# EAGLE design DS2786 (EAGLE 7.3.0)
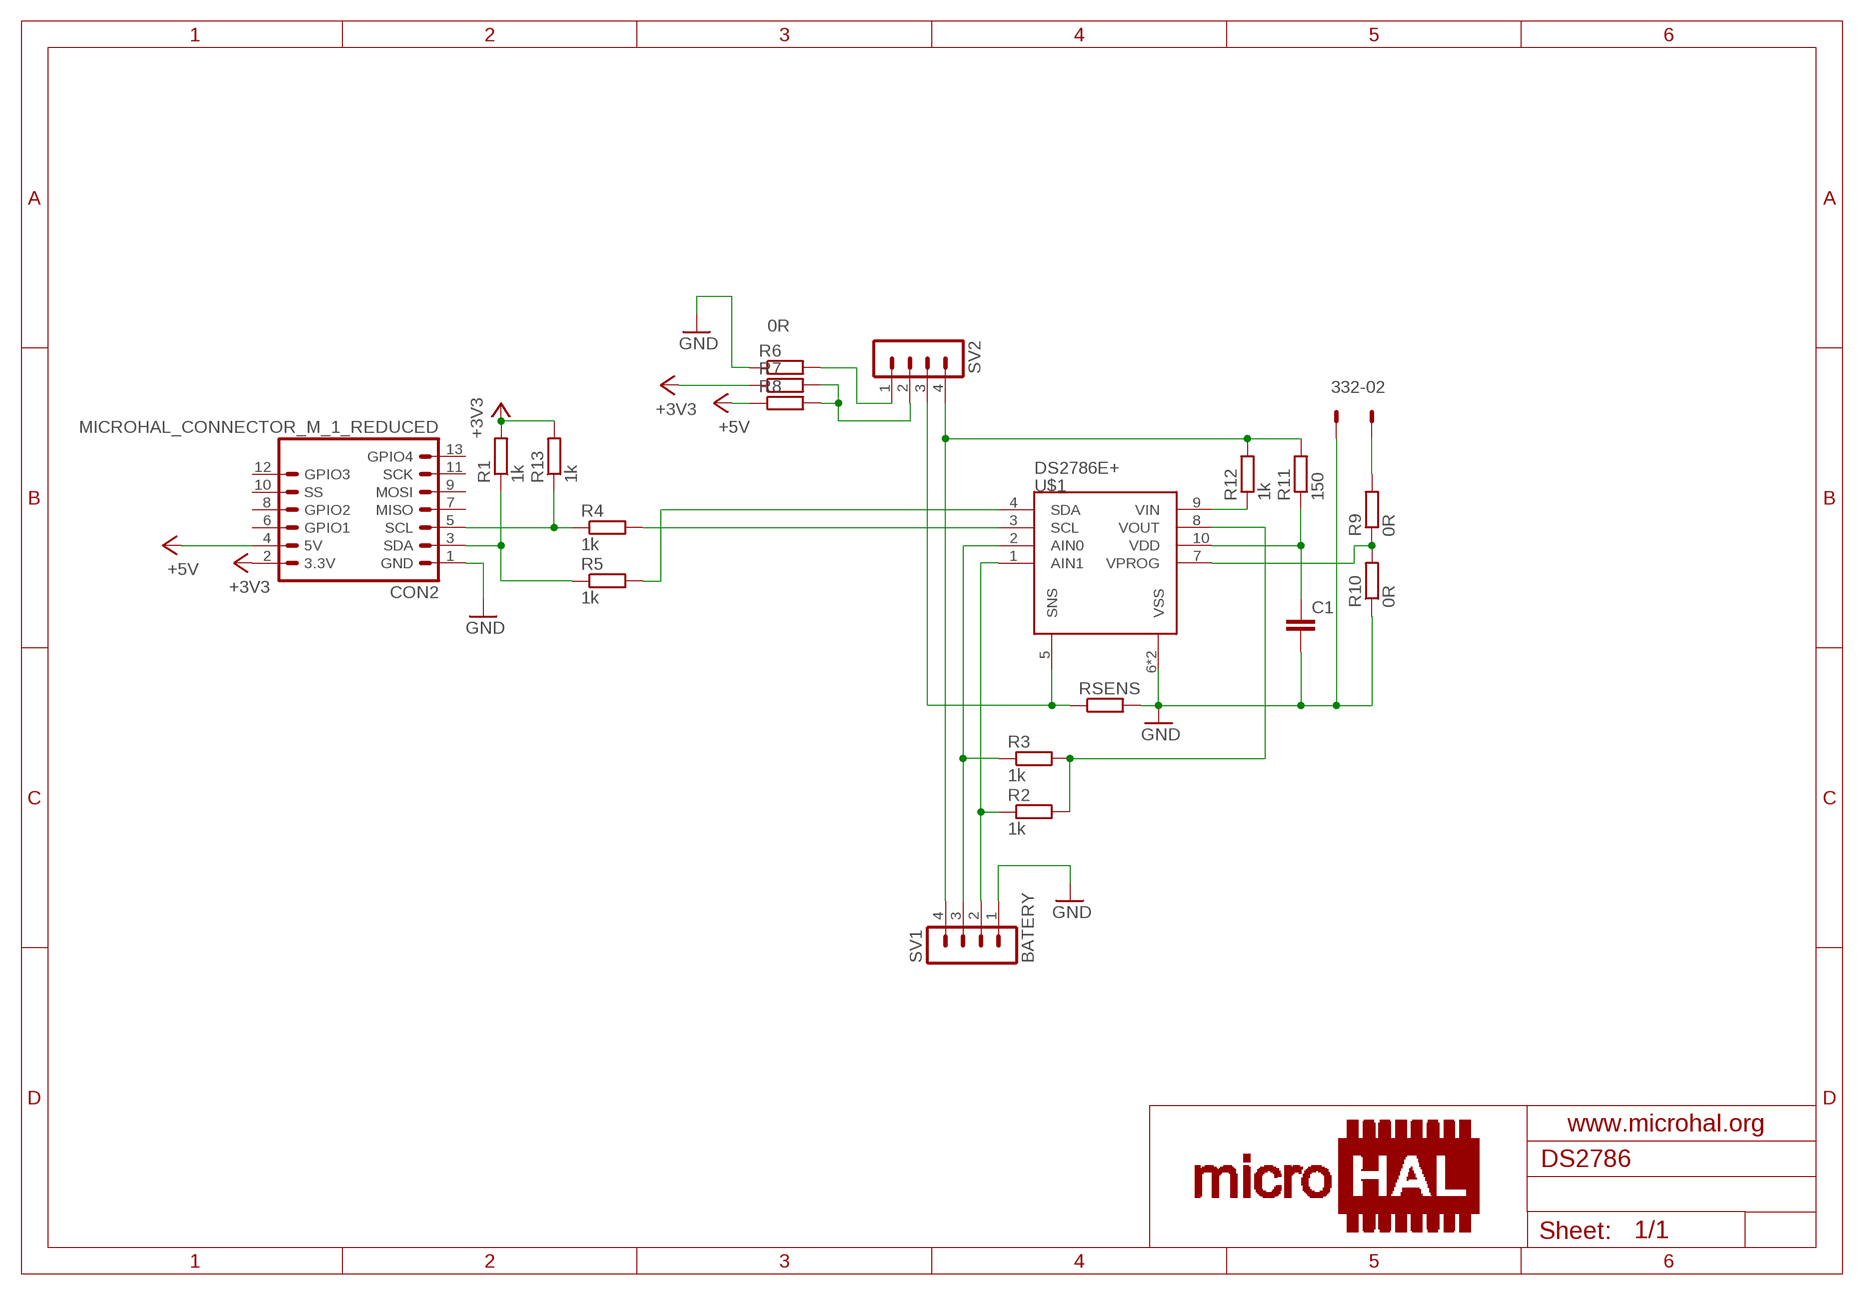
[diagram p0: schematic, sheet 1]

## Parts
C1  C-EUC0603  [C0603]
CON2  MICROHAL_CONNECTOR_M_1_REDUCED  [MICROHAL_CONNECTOR_M_1_REDUCED_EDGE]
R1  1k  R-EU_R0603  [R0603]
R2  1k  R-EU_R0603  [R0603]
R3  1k  R-EU_R0603  [R0603]
R4  1k  R-EU_R0603  [R0603]
R5  1k  R-EU_R0603  [R0603]
R6  R-EU_R0603  [R0603]
R7  R-EU_R0603  [R0603]
R8  R-EU_R0603  [R0603]
R9  0R  R-EU_R0603  [R0603]
R10  0R  R-EU_R0603  [R0603]
R11  150  R-EU_R0603  [R0603]
R12  1k  R-EU_R0603  [R0603]
R13  1k  R-EU_R0603  [R0603]
RSENS  R-EU_R1206  [R1206]
SV1  BATERY  MA04-1  [MA04-1]
SV2  MA04-1  [MA04-1]
U$1  DS2786E+  [TDFN-10]
X1  332-02  [332-02]

## Nets
+3V3: CON2.2(3.3V) R1.2 R7.1 R13.2
+5V: CON2.4(5V) R8.1
GND: C1.2 CON2.1(GND) R6.1 R10.1 RSENS.2 SV1.1 U$1.6(VSS) U$1.PAD1(VSS) X1.1
N$1: R9.2 X1.2
N$3: R2.2 R3.2 U$1.8(VOUT)
N$4: RSENS.1 SV2.3 U$1.5(SNS)
N$6: CON2.5(SCL) R4.1 R13.1
N$7: CON2.3(SDA) R1.1 R5.1
N$8: R4.2 U$1.3(SCL)
N$9: R5.2 U$1.4(SDA)
N$10: R11.2 R12.2 SV1.4 SV2.4
N$11: R6.2 SV2.1
N$12: R7.2 R8.2 SV2.2
N$15: C1.1 R11.1 U$1.10(VDD)
N$16: R9.1 R10.2 U$1.7(VPROG)
N$17: R12.1 U$1.9(VIN)
N$18: R2.1 SV1.2 U$1.1(AIN1)
N$20: R3.1 SV1.3 U$1.2(AIN0)
Unconnected: CON2.6(GPIO1) CON2.7(MISO) CON2.8(GPIO2) CON2.9(MOSI) CON2.10(SS) CON2.11(SCK) CON2.12(GPIO3) CON2.13(GPIO4)

## Notes on the sheet
- 0R

## Library data of the parts
C1 = rcl:C-EU: CAPACITOR, European symbol
CON2 = microhal-connector_v0.1:MICROHAL_CONNECTOR_M_1_REDUCED
R1-R13 RSENS = rcl:R-EU_: RESISTOR, European symbol
SV1 SV2 = con-lstb:MA04-1: PIN HEADER; OC_FARNELL: unknown; OC_NEWARK: unknown
U$1 = DS2786:DS2786E+
X1 = con-garry:332-02: 2 Pin - 2mm Dual Row Source: www.mpe-connector.de / garry_shortform_2012.pdf

## Board
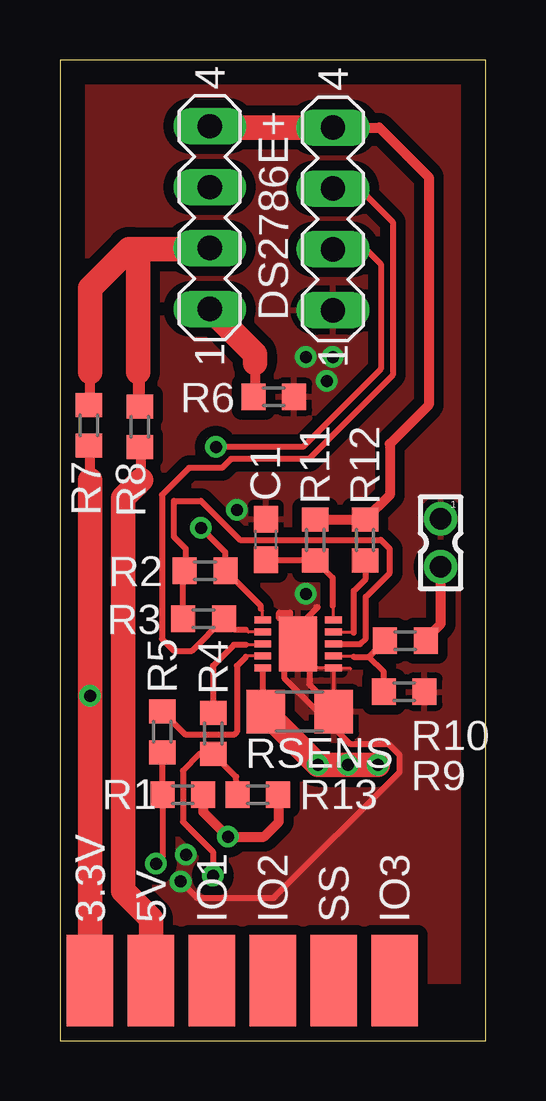
[diagram p1: board, top side]
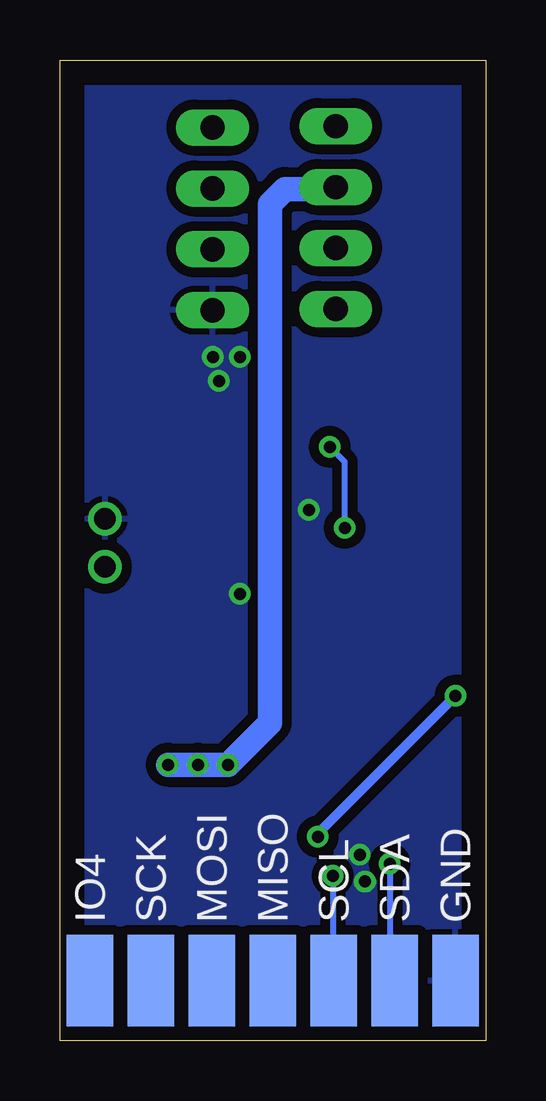
[diagram p2: board, bottom side, seen from below]

Size 17.75 x 40.88 mm. Coordinates in mm from the lower left corner, seen from the top.
Outline: 0,0 17.75,0 17.75,40.88 0,40.88 0,0
Copper layers (1*16): Top 0.035mm / dielectric 1.5mm / Bottom 0.035mm
Design rules "default": minimum track width 10mil, minimum drill 24mil, track to track 8mil, track to pad 8mil, pad to pad 8mil, via to via 8mil, smd to smd 8mil, copper to edge 40mil, drill to drill 8mil, minimum pad ring 10mil, minimum via ring 8mil, stop-mask expansion 4mil, vias tented up to drill 0mil, thermal gap 10mil

### Footprints (pad centres in the part's own frame; a part is rotated, then mirrored left to right if it is on the bottom)
C0603 = smd 1.1 x 1: 1 -0.85,0; 2 0.85,0
MICROHAL_CONNECTOR_M_1_REDUCED_EDGE = smd 1.93 x 3.81 bottom: 1 -7.62,0; 3 -5.08,0; 5 -2.54,0; 7 0,0; 9 2.54,0; 11 5.08,0; 13 7.62,0 | smd 1.93 x 3.81: 2 -7.62,0; 4 -5.08,0; 6 -2.54,0; 8 0,0; 10 2.54,0; 12 5.08,0
R0603 = smd 1 x 1.1: 1 -0.85,0; 2 0.85,0
R1206 = smd 1.6 x 1.803: 1 -1.422,0; 2 1.422,0
MA04-1 = drill 1.016 long: 1 -3.81,0; 2 -1.27,0; 3 1.27,0; 4 3.81,0
TDFN-10 = smd 0.7 x 0.3: 1 -1.475,1; 2 -1.475,0.5; 3 -1.475,0; 4 -1.475,-0.5; 5 -1.475,-1; 6 1.475,-1; 7 1.475,-0.5; 8 1.475,0; 9 1.475,0.5; 10 1.475,1 | smd 1.58 x 2.3: PAD1 0,0
332-02 = drill 0.9 pad 1.27: 1 0,-1; 2 0,1

### Placement (x,y rotation side)
C1  8.59,20.89 90 top
CON2  8.88,2.5 0 top
R1  5.12,10.25 0 top
R2  6.05,19.59 180 top
R3  5.99,17.59 180 top
R4  6.39,12.8 90 top
R5  4.27,12.87 90 top
R6  8.92,26.84 180 top
R7  1.21,25.64 90 top
R8  3.33,25.59 90 top
R9  14.4,16.66 0 top
R10  14.35,14.54 180 top
R11  10.64,20.86 90 top
R12  12.72,20.86 90 top
R13  8.25,10.25 0 top
RSENS  10,13.71 0 top
SV1  11.38,34.25 90 top
SV2  6.25,34.3 90 top
U$1  9.93,16.53 0 top
X1  15.88,20.75 180 top

### Tracks (layer width: path | path; a pad name or v marks a point on that pad's centre or on a via)
+3V3  (via drill 0.5)
  Top 0.406: 1.25,23.38 1.25,24.75 R7.1 | R13.2 9.12,10.22 9.12,9.12 8.5,8.5 v7,8.5 5.97,9.53 R1.2
  Top 1.016: CON2.2 v1.25,14.38 1.25,23.37 1.25,23.38
  Bottom 0.406: v7,8.5 7,8.63 v1.25,14.38
+5V
  Top 0.406: 3.38,23.38 3.38,24.7 R8.1
  Top 1.016: CON2.4 3.79,5.08 2.62,6.25 2.62,22.62 3.38,23.38
GND  (via drill 0.5)
  Top 0.128: U$1.6 12.1,15.53 12.12,15.5 | U$1.6 10.4,15.53 10.38,15.5 | RSENS.2 11.42,15.51 U$1.6
  Top 0.254: 10.4,15.53 10.4,14.85 11.5,13.75 | v5.03,6.63 5.71,5.94 8.91,5.94 14.17,11.2 14.17,11.89 13.72,12.34 12.12,12.34 9.37,15.09 9.37,17.6 9.14,17.6 9.14,17.83 9.6,17.83 9.6,16.23 10.29,16.23 10.29,17.6 10.74,18.06 10.68,18.06
  other vias: 7.38,22.12 10.25,28.5 11.38,28.5 11.12,27.5 10.25,18.62 5.25,7.75
  pour Bottom (isolate 0.406): 0,2.5 17.75,2.5 17.75,40.88 0,40.88
  pour Top (isolate 0.406): 0,2.5 17.75,2.5 17.75,40.88 0,40.88
N$1
  Top 0.406: R9.2 15.25,16.75 15.88,17.38 X1.2
N$3
  Top 0.128: U$1.8 12.22,16.53 12.25,16.5
  Top 0.254: R3.2 5.13,19.52 R2.2 5.25,19.64 5.25,20.5 4.75,21 4.75,22.5 5.88,22.5 7.5,20.88 13.38,20.88 13.75,20.5 13.75,19.5 12.75,18.5 12.75,16.75 12.53,16.53 U$1.8
N$4  (via drill 0.5)
  Top 0.254: RSENS.1 8.58,13.8 8.5,13.88 8.46,13.92 U$1.5 8.46,13.83 RSENS.1
  Top 1.016: 8.5,13.88 8.5,13.75 v10.75,11.5 v12,11.5 v13.25,11.5
  Bottom 1.016: v13.25,11.5 v12,11.5 v10.75,11.5 9,13.25 9,34.88 8.38,35.5 6.32,35.5 SV2.3
N$6  (via drill 0.5)
  Top 0.254: R13.1 7.35,11 R4.1 5.83,11.96 5.12,11.25 5.12,9.12 6.38,7.88 v6.38,6.88
  Bottom 0.254: v6.38,6.88 6.38,2.54 CON2.5
N$7  (via drill 0.5)
  Top 0.254: v4,7.38 4.28,7.65 R1.1 R5.1
  Bottom 0.254: v4,7.38 4,2.71 CON2.3
N$8
  Top 0.128: U$1.3 8.5,16.5 7.75,16.5
  Top 0.254: 7.75,16.5 7.25,16.5 6.38,15.62 6.38,13.68 R4.2
N$9
  Top 0.128: U$1.4 7.78,16.03 7.75,16
  Top 0.254: 7.75,16 7.38,15.62 7.38,12.88 7.25,12.75 5.24,12.75 R5.2
N$10
  Top 0.406: SV1.4 13.31,38.06 15.38,36 15.38,26.5 13.75,24.88 13.75,22.73 R12.2 R11.2
  Top 1.016: SV1.4 6.3,38.06 SV2.4
N$11
  Top 0.406: 8.12,28.25 8.12,26.89 R6.2
  Top 1.016: SV2.1 8.12,28.62 8.12,28.25
N$12
  Top 0.406: R7.2 1.25,26.5 1.25,27.88 | R8.2 3.25,26.43 3.25,27.88 3.33,27.79 R8.2
  Top 1.016: 1.25,27.88 1.25,31.38 2.88,33 3.25,32.62 | 3.25,27.88 3.25,32.62 | 3.25,32.62 3.25,32.75 3,33 6.21,33 SV2.2
N$15
  Top 0.128: U$1.10 11.4,18.09 11.38,18.12
  Top 0.254: 11.38,18.12 11.38,19.29 R11.1 8.61,20.02 C1.1
N$16
  Top 0.128: U$1.7 12.22,16.03 12.25,16
  Top 0.254: 12.25,16 12.88,16 | 12.88,16 R9.1 | R10.2 13.5,15.38 12.88,16
N$17
  Top 0.128: U$1.9 12.22,17.03 12.25,17
  Top 0.254: 12.25,17 12.25,18.75 12.75,19.25 12.75,19.98 R12.1
N$18  (via drill 0.5)
  Top 0.128: U$1.1 8.46,17.92 8.38,18
  Top 0.254: 8.38,18 8.38,18.11 R2.1 6.9,20.35 v5.88,21.38 | SV1.2 12.77,32.98 13.38,32.38 13.38,28 10.12,24.75 v6.5,24.75
  Bottom 0.254: v5.88,21.38 5.88,24.12 v6.5,24.75
N$20
  Top 0.128: U$1.2 7.84,17.03 7.75,17.12
  Top 0.254: 7.75,17.12 7.29,17.12 R3.1 5.5,16.25 4.75,16.25 4.25,16.75 4.25,22.75 5.38,23.88 6.75,23.88 7.12,24.25 10.38,24.25 13.88,27.75 13.88,34.12 12.48,35.52 SV1.3

### Text on the board
tTest: PACK+ / / PACK- / / RETU+ / / RETU- | BAT+ / / BAT_ID / / TEMP / / BAT- | VPROG